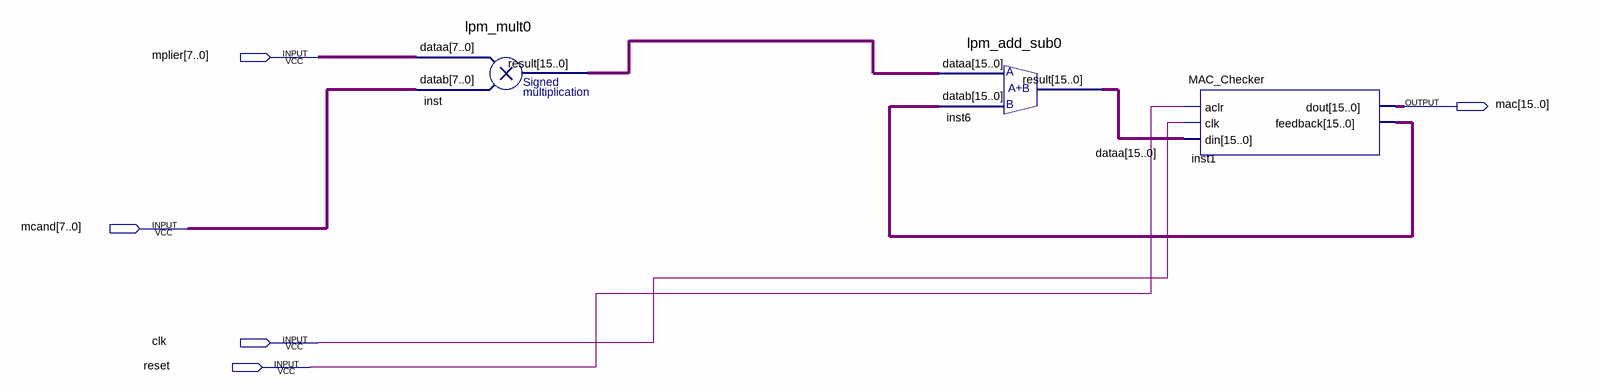
[diagram p0: schematic sheet]
// Quartus schematic MAC.bdf as structural Verilog: 3 symbols, 5 pins
module MAC (
  input  [7:0] mplier,
  input  [7:0] mcand,
  input  clk,
  input  reset,
  output [15:0] mac
);

  wire [15:0] dataa, inst1_feedback, inst_result;

  lpm_mult0 inst (.dataa(mplier), .datab(mcand), .result(inst_result));
  lpm_add_sub0 inst6 (.dataa(inst_result), .datab(inst1_feedback), .result(dataa));
  MAC_Checker inst1 (.aclr(reset), .clk(clk), .din(dataa), .dout(mac), .feedback(inst1_feedback));
endmodule
